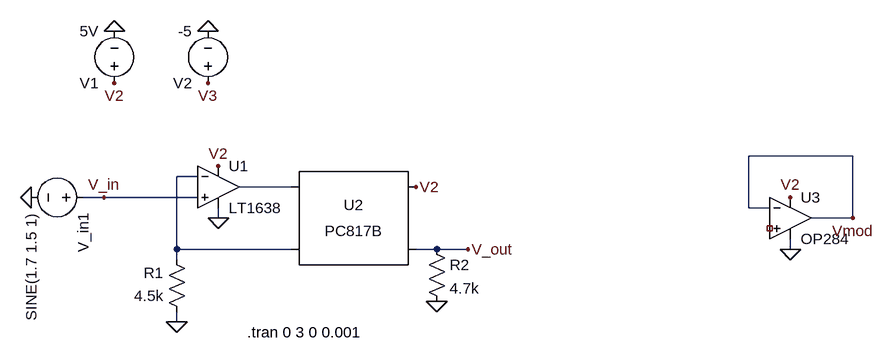
[diagram p0: schematic Part1_Circuit.asc]
Part1_Circuit.asc, the LTspice schematic file:
Version 4
SHEET 1 1012 680
WIRE 960 112 800 112
WIRE -48 144 -80 144
WIRE 96 160 16 160
WIRE -192 176 -224 176
WIRE -48 176 -192 176
WIRE 800 192 800 112
WIRE 832 192 800 192
WIRE -16 208 -16 192
WIRE 960 208 960 112
WIRE 960 208 896 208
WIRE -80 256 -80 144
WIRE 96 256 -80 256
WIRE 320 256 288 256
WIRE 368 256 320 256
WIRE 864 256 864 240
WIRE -80 272 -80 256
WIRE -80 368 -80 352
FLAG -304 176 0
FLAG -80 368 0
FLAG -16 208 0
FLAG 288 160 V2
FLAG -16 128 V2
FLAG -192 176 V_in
FLAG 864 176 V2
FLAG 864 256 0
FLAG 960 208 Vmod
FLAG -176 0 V2
FLAG -176 -80 0
FLAG -32 0 V3
FLAG -32 -80 0
FLAG 320 336 0
FLAG 368 256 V_out
SYMBOL voltage -208 176 R90
WINDOW 123 0 0 Left 0
WINDOW 39 0 0 Left 0
SYMATTR InstName V_in1
SYMATTR Value SINE(1.7 1.5 1)
SYMBOL res -64 368 R180
WINDOW 0 36 76 Left 2
WINDOW 3 36 40 Left 2
SYMATTR InstName R1
SYMATTR Value 4.5k
SYMBOL OpAmps\\LT1638 -16 96 R0
SYMATTR InstName U1
SYMBOL Optos\\PC817B 192 208 R0
SYMATTR InstName U2
SYMBOL Opamps\\OP284 864 144 R0
SYMATTR InstName U3
SYMBOL voltage -176 16 R180
WINDOW 123 0 0 Left 0
WINDOW 39 0 0 Left 0
SYMATTR InstName V1
SYMATTR Value 5V
SYMBOL voltage -32 16 R180
WINDOW 123 0 0 Left 0
WINDOW 39 0 0 Left 0
SYMATTR InstName V2
SYMATTR Value -5
SYMBOL res 304 240 R0
SYMATTR InstName R2
SYMATTR Value 4.7k
TEXT 28 384 Left 2 !.tran 0 3 0 0.001

The netlist it stands for:
* Part1_Circuit.asc
V_in1 V_in 0 SINE(1.7 1.5 1)
R1 0 N001 4.5k
XU1 V_in N001 V2 0 N002 LT1638  ; pins In+ In- V+ V- OUT
XU2 N002 N001 V2 V_out PC817 Igain=1.5m
XU3 NC_01 Vmod V2 0 Vmod OP284  ; pins In+ In- V+ V- OUT
V1 V2 0 5V
V2 V3 0 -5
R2 V_out 0 4.7k
.tran 0 3 0 0.001
.lib PC817.sub
.lib ADI1.lib
.backanno
.end